# EAGLE design chargemaster (EAGLE 6.6.0)
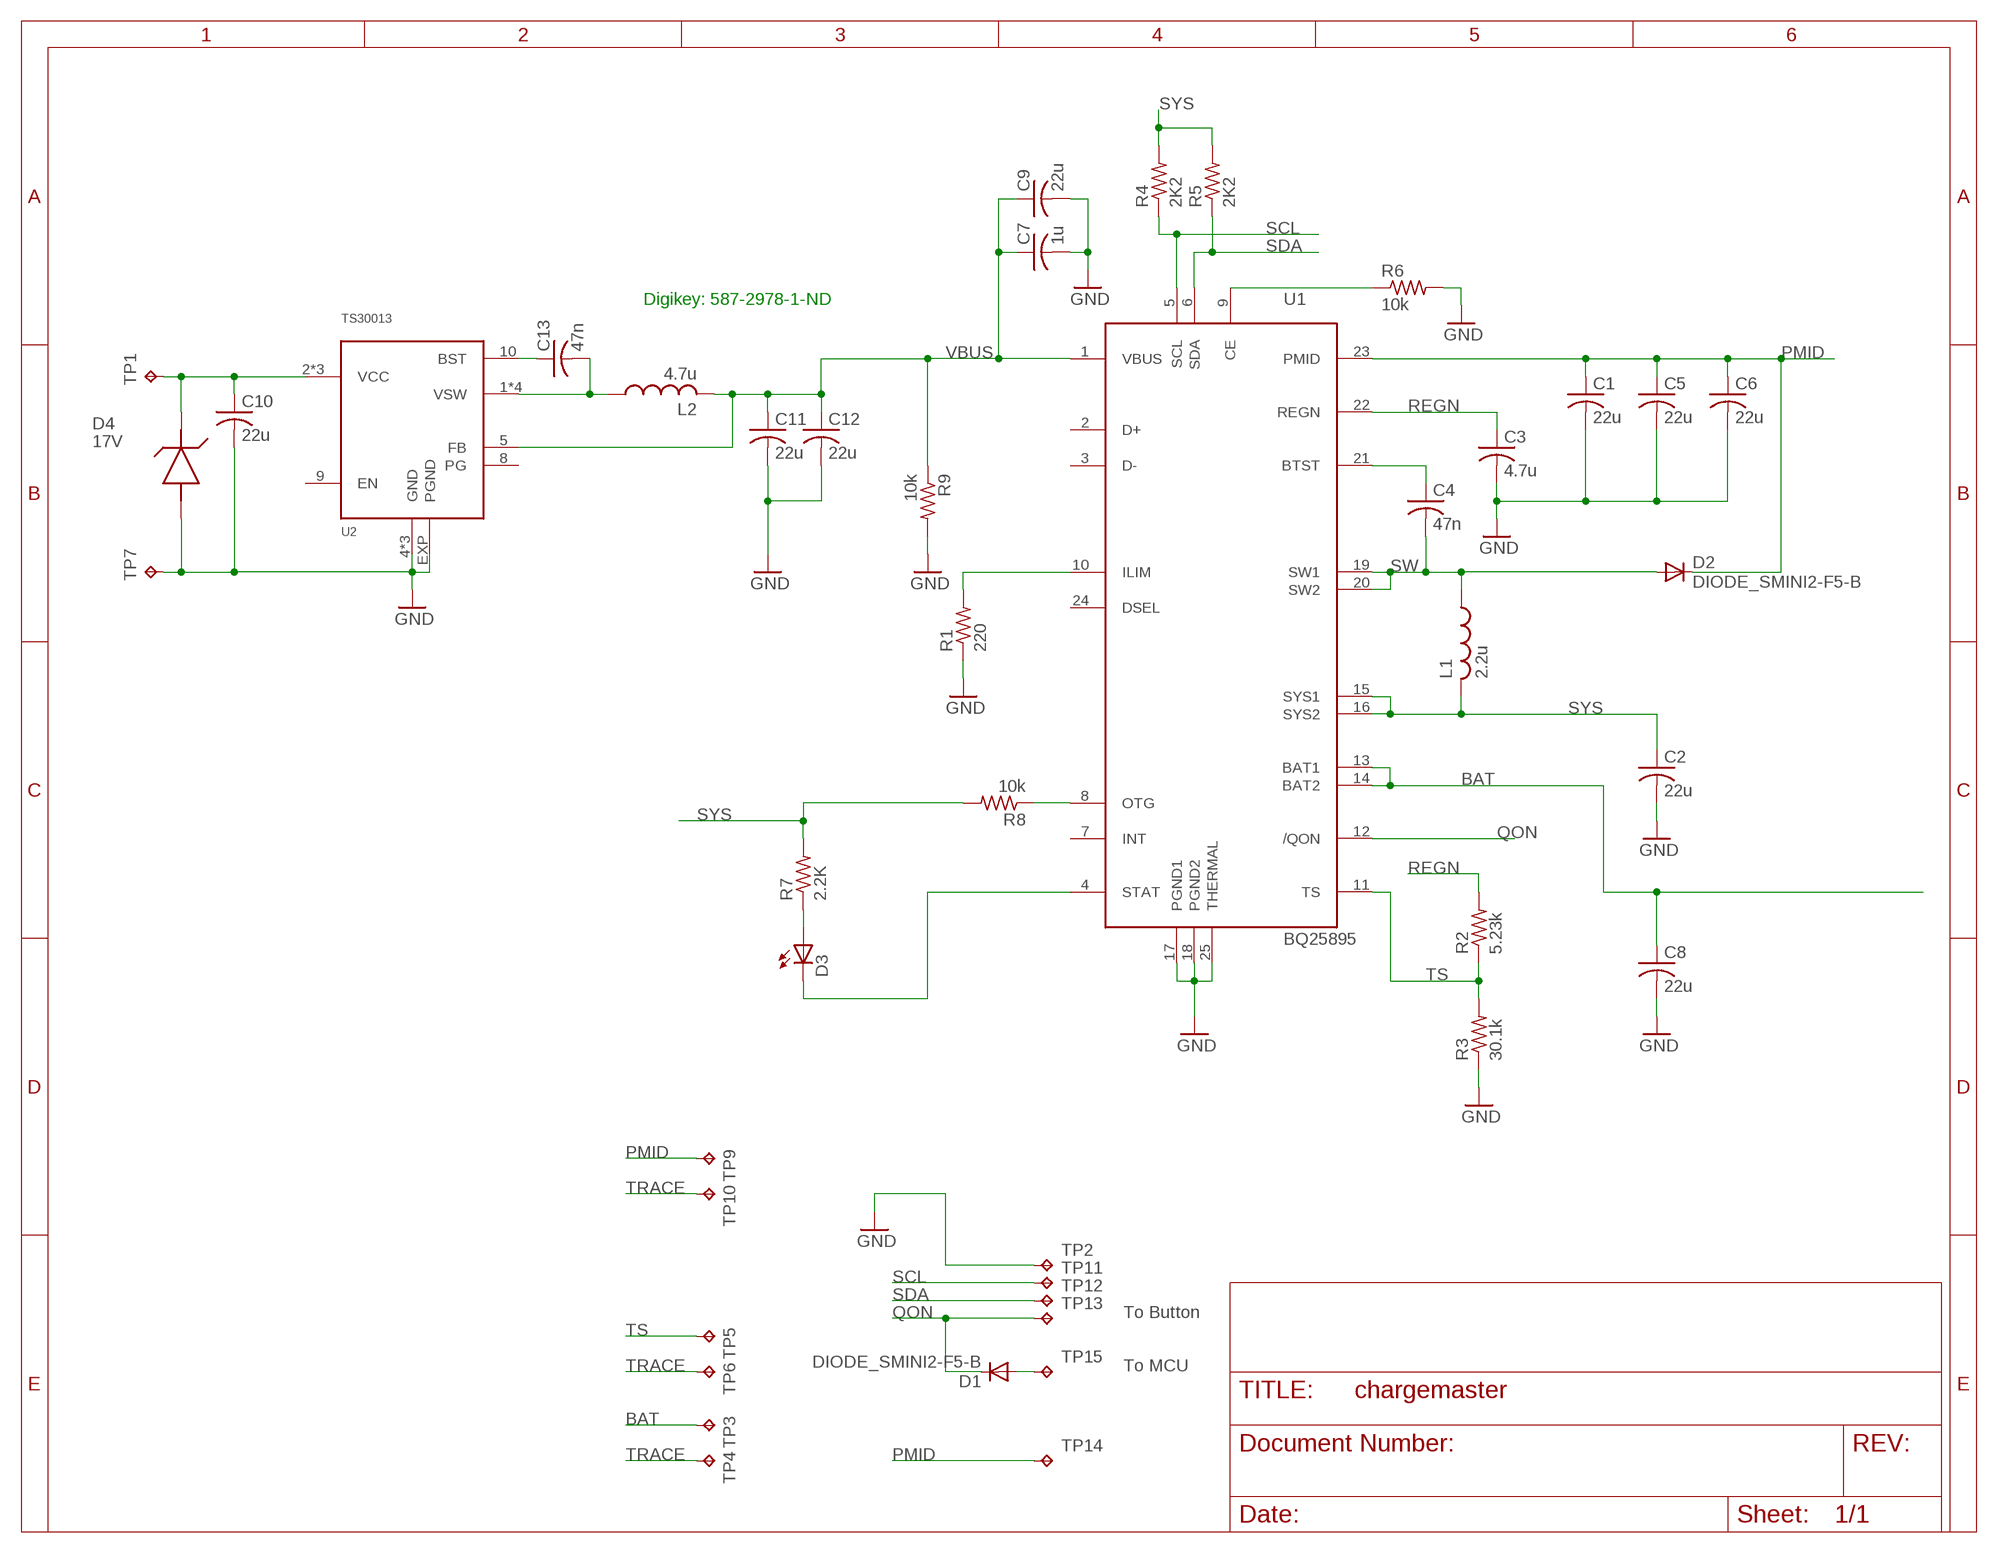
[diagram p0: schematic, sheet 1]

## Parts
C1  22u  C-USC1206  [C1206]
C2  22u  C-USC1206  [C1206]
C3  4.7u  C-USC0805  [C0805]
C4  47n  C-USC0402  [C0402]
C5  22u  C-USC1206  [C1206]
C6  22u  C-USC1206  [C1206]
C7  1u  C-USC0603  [C0603]
C8  22u  C-USC1206  [C1206]
C9  22u  C-USC1206  [C1206]
C10  22u  C-USC1206  [C1206]
C11  22u  C-USC1206  [C1206]
C12  22u  C-USC1206  [C1206]
C13  47n  C-USC0402  [C0402]
D1  DIODE_SMINI2-F5-B  [SMINI2-F5-B]
D2  DIODE_SMINI2-F5-B  [SMINI2-F5-B]
D3  LEDCHIP-LED0805  [CHIP-LED0805]
D4  17V  SMA_TVS  [SMA]
L1  2.2u  SRN8040TA  [SRN8040TA]
L2  4.7u  SRN8040TA  [SRN8040TA]
R1  220  R-US_R0603  [R0603]
R2  5.23k  R-US_R0603  [R0603]
R3  30.1k  R-US_R0603  [R0603]
R4  2K2  R-US_R0603  [R0603]
R5  2K2  R-US_R0603  [R0603]
R6  10k  R-US_R0603  [R0603]
R7  2.2K  R-US_R0603  [R0603]
R8  10k  R-US_R0603  [R0603]
R9  10k  R-US_R0603  [R0603]
TP1  TPPAD1-13Y  [P1-13Y]
TP2  TPPAD1-13Y  [P1-13Y]
TP3  TPPAD1-13Y  [P1-13Y]
TP4  TPPAD1-13Y  [P1-13Y]
TP5  TPPAD1-13Y  [P1-13Y]
TP6  TPPAD1-13Y  [P1-13Y]
TP7  TPPAD1-13Y  [P1-13Y]
TP9  TPPAD1-13Y  [P1-13Y]
TP10  TPPAD1-13Y  [P1-13Y]
TP11  TPPAD1-13Y  [P1-13Y]
TP12  TPPAD1-13Y  [P1-13Y]
TP13  TPPAD1-13Y  [P1-13Y]
TP14  TPPAD1-13Y  [P1-13Y]
TP15  TPPAD1-13Y  [P1-13Y]
U1  BQ25895  [QFN24_4X4]
U2  TS30013  [QFN16_3X3]

## Nets
BAT: C8.1 TP3.TP U1.13(BAT1) U1.14(BAT2)
BST: C13.1 U2.10(BST)
BTST: C4.1 U1.21(BTST)
N$1: D3.A R7.1
N$2: D3.C U1.4(STAT)
N$3: R1.2 U1.10(ILIM)
N$4: D1.P$1(A) TP15.TP
N$6: R6.1 U1.9(CE)
N$9: R8.1 U1.8(OTG)
PMID: C1.1 C5.1 C6.1 D2.P$2(C) TP9.TP TP14.TP U1.23(PMID)
QON: D1.P$2(C) TP13.TP U1.12(/QON)
REGN: C3.1 R2.2 U1.22(REGN)
SCL: R4.1 TP11.TP U1.5(SCL)
SDA: R5.1 TP12.TP U1.6(SDA)
SW: C4.2 D2.P$1(A) L1.P$1 U1.19(SW1) U1.20(SW2)
SYS: C2.1 L1.P$2 R4.2 R5.2 R7.2 R8.2 U1.15(SYS1) U1.16(SYS2)
TRACE: C1.2 C2.2 C3.2 C5.2 C6.2 C7.2 C8.2 C9.2 C10.2 C11.2 C12.2 D4.P$2(GND) R1.1 R3.1 R6.2 R9.2 TP2.TP TP4.TP TP6.TP TP7.TP TP10.TP U1.17(PGND1) U1.18(PGND2) U1.25(THERMAL) U2.4(GND) U2.14(GND) U2.15(GND) U2.EXP(PGND) ; supply symbol labelled GND
TS: R2.1 R3.2 TP5.TP U1.11(TS)
VBUS: C7.1 C9.1 C11.1 C12.1 L2.P$2 R9.1 U1.1(VBUS) U2.5(FB)
VIN: C10.1 D4.P$1(LINE) TP1.TP U2.2(VCC) U2.3(VCC) U2.11(VCC)
VSW: C13.2 L2.P$1 U2.1(VSW) U2.12(VSW) U2.13(VSW) U2.16(VSW)
Unconnected: U1.2(D+) U1.3(D-) U1.7(INT) U1.24(DSEL) U2.8(PG) U2.9(EN)

## Notes on the sheet
- Digikey: 587-2978-1-ND
- To Button
- To MCU

## Library data of the parts
C1-C13 = rcl:C-US: CAPACITOR, American symbol
D1 D2 = sapphire:DIODE_SMINI2-F5-B
D3 = adafruit:LED: LED OSRAM: - CHIPLED LG R971, LG N971, LY N971, LG Q971, LY Q971, LO R971, LY R971 LH N974, LH R974 LS Q976, LO Q976, LY Q976 LO Q996 - Hyper CHIPLED LW Q18S LB Q993, LB Q99A, LB R99A - SideLED LS A670, LO A670, LY A670, LG A670, LP A670 LB A673, LV A673, LT A673, LW A673 LH A674 LY A675 LS A676, LA A676, LO A676, LY A676, LW A676 LS A679, LY A679, LG A679 - Hyper Micro SIDELED® LS Y876, LA Y876, LO Y876, LY Y876 LT Y87S - SmartLED LW L88C, LW L88S LB L89C, LB L89S, LG L890 LS L89K, LO L89K, LY L89K LS L896, LA L896, LO L896, LY L896 - TOPLED LS T670, LO T670, LY T670, LG T670, LP T670 LSG T670, LSP T670, LSY T670, LOP T670, LYG T670 LG T671, LOG T671, LSG T671 LB T673, LV T673, LT T673, LW T673 LH T674 LS T676, LA T676, LO T676, LY T676, LB T676, LH T676, LSB T676, LW T676 LB T67C, LV T67C, LT T67C, LS T67K, LO T67K, LY T67K, LW E67C LS E67B, LA E67B, LO E67B, LY E67B, LB E67C, LV E67C, LT E67C LW T67C LS T679, LY T679, LG T679 LS T770, LO T770, LY T770, LG T770, LP T770 LB T773, LV T773, LT T773, LW T773 LH T774 LS E675, LA E675, LY E675, LS T675 LS T776, LA T776, LO T776, LY T776, LB T776 LHGB T686 LT T68C, LB T68C - Hyper Mini TOPLED® LB M676 - Mini TOPLED Santana® LG M470 LS M47K, LO M47K, LY M47K Source: http://www.osram.convergy.de/
D4 = sapphire:SMA_TVS
L1 L2 = sapphire:SRN8040TA
R1-R9 = rcl:R-US_: RESISTOR, American symbol
TP1-TP7 TP9-TP15 = testpad:TP: Test pad
U1 = sapphire:BQ25895
U2 = sapphire:TS30013

## Board
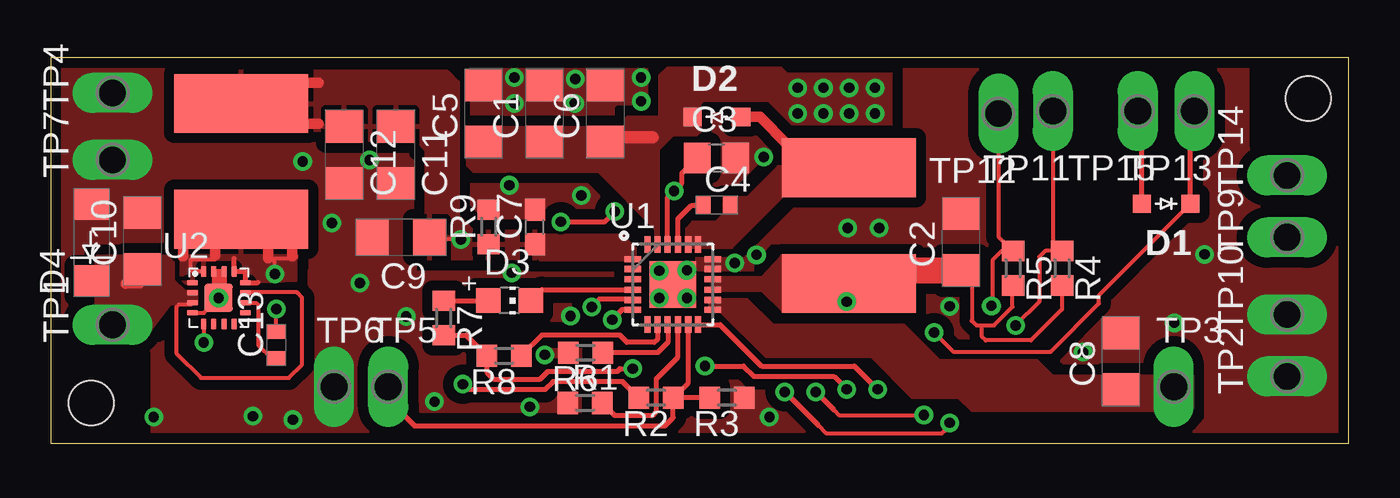
[diagram p1: board, top side]
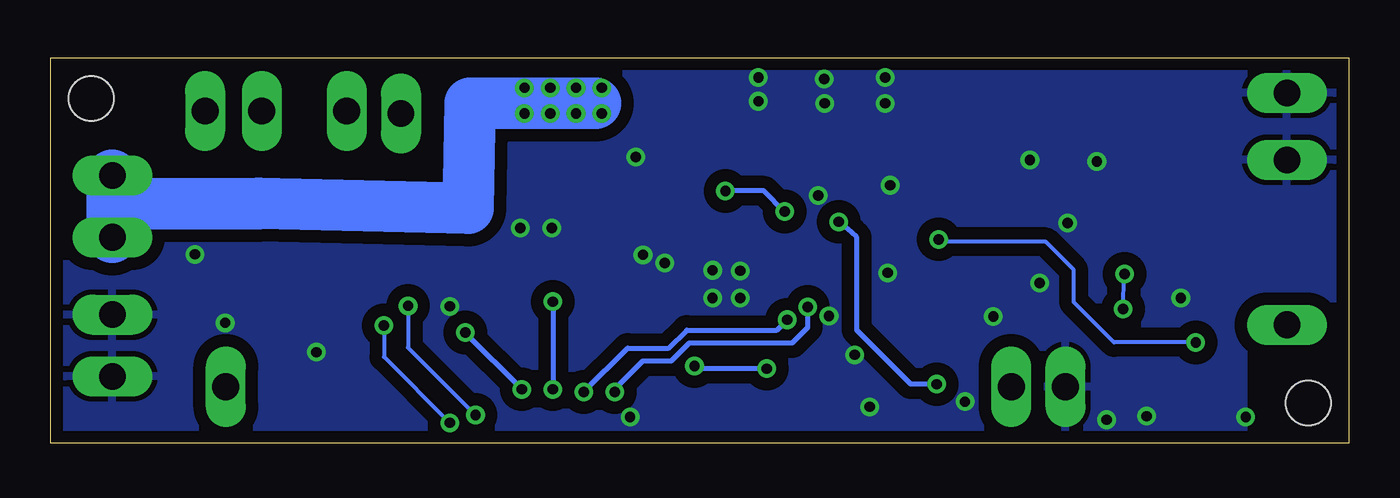
[diagram p2: board, bottom side, seen from below]

Size 64 x 19 mm. Coordinates in mm from the lower left corner, seen from the top.
Outline: 0,0 64,0 64,19 0,19 0,0
Copper layers (1*16): Top 0.035mm / dielectric 1.5mm / Bottom 0.035mm
Design rules "default *": minimum track width 6mil, minimum drill 20mil, track to track 6mil, track to pad 6mil, pad to pad 6mil, via to via 6mil, smd to smd 6mil, copper to edge 15mil, drill to drill 6mil, minimum pad ring 10mil, minimum via ring 8mil, stop-mask expansion 4mil, vias tented up to drill 0mil, thermal gap 10mil
Holes 2.2 mm at 2,2 62,17
tKeepout: area -0.1,0 to 0.4,19.1; area 0,-0.1 to 64,0.4; area 63.6,0 to 64.1,19.1; area -0.1,18.6 to 64,19.1
tRestrict: area 59.6,14.7 to 63.6,18.7; area 0.4,0.4 to 4.4,4.4
bRestrict: area 59.6,14.7 to 63.6,18.7; area 0.4,0.4 to 4.4,4.4

### Footprints (pad centres in the part's own frame; a part is rotated, then mirrored left to right if it is on the bottom)
C1206 = smd 1.6 x 1.8: 1 -1.4,0; 2 1.4,0
C0805 = smd 1.3 x 1.5: 1 -0.95,0; 2 0.95,0
C0402 = smd 0.7 x 0.9: 1 -0.65,0; 2 0.65,0
C0603 = smd 1.1 x 1: 1 -0.85,0; 2 0.85,0
SMINI2-F5-B = smd 0.9 x 0.9: P$1 0,1.2; P$2 0,-1.2
CHIP-LED0805 = smd 1.2 x 1.2: A 0,-1.05; C 0,1.05
SMA = smd 1.524 x 1.676: P$1 -1.829,-0.051; P$2 1.93,-0.051
SRN8040TA = smd 6.6 x 2.9: P$1 3.3,1.4; P$2 3.3,7.1
R0603 = smd 1 x 1.1: 1 -0.85,0; 2 0.85,0
P1-13Y = drill 1.321 pad 1.905 long: TP 0,0
QFN24_4X4 = smd 0.813 x 0.305: 1 -1.98,1.245; 2 -1.98,0.762; 3 -1.98,0.254; 4 -1.98,-0.254; 5 -1.98,-0.762; 6 -1.98,-1.245; 13 1.98,-1.245; 14 1.98,-0.762; 15 1.98,-0.254; 16 1.98,0.254; 17 1.98,0.762; 18 1.98,1.245 | smd 0.305 x 0.813: 7 -1.245,-1.98; 8 -0.762,-1.98; 9 -0.254,-1.98; 10 0.254,-1.98; 11 0.762,-1.98; 12 1.245,-1.98; 19 1.245,1.98; 20 0.762,1.98; 21 0.254,1.98; 22 -0.254,1.98; 23 -0.762,1.98; 24 -1.245,1.98 | smd 2.286 x 2.286: 25 0,0
QFN16_3X3 = smd 0.559 x 0.279: 1 -1.387,0.818; 2 -1.387,0.318; 3 -1.387,-0.182; 4 -1.387,-0.682; 9 1.212,-0.682; 10 1.212,-0.182; 11 1.212,0.318; 12 1.212,0.818 | smd 0.279 x 0.559: 5 -0.838,-1.232; 6 -0.338,-1.232; 7 0.163,-1.232; 8 0.662,-1.232; 13 0.662,1.367; 14 0.163,1.367; 15 -0.338,1.367; 16 -0.838,1.367 | smd 1.4 x 1.4: EXP -0.107,0.068

### Placement (x,y rotation side)
C1  24.34,16.25 90 top
C2  44.87,9.93 90 top
C3  32.83,14.07 0 top
C4  32.84,11.75 0 top
C5  21.34,16.25 90 top
C6  27.34,16.25 90 top
C7  23.88,10.67 90 top
C8  52.77,4.05 90 top
C9  17.27,10.16 180 top
C10  4.52,9.98 90 top
C11  17.02,14.22 270 top
C12  14.48,14.22 270 top
C13  11.13,4.85 90 top
D1  54.99,11.81 90 top
D2  32.84,16.09 270 top
D3  22.63,7.04 270 top
D4  1.98,9.86 90 top
L1  42.66,14.98 180 top
L2  6.1,9.65 0 top
R1  26.34,2 0 top
R2  29.84,2.25 180 top
R3  33.34,2.25 180 top
R4  49.86,8.64 270 top
R5  47.45,8.64 270 top
R6  26.37,4.47 180 top
R7  19.38,6.18 270 top
R8  22.35,4.32 180 top
R9  21.59,10.67 90 top
TP1  3.05,5.84 90 top
TP2  60.96,3.3 90 top
TP3  55.37,2.79 0 top
TP4  3.05,17.27 90 top
TP5  16.64,2.79 0 top
TP6  13.97,2.79 0 top
TP7  3.05,13.97 90 top
TP9  60.96,10.16 90 top
TP10  60.96,6.35 90 top
TP11  49.4,16.38 180 top
TP12  46.74,16.26 180 top
TP13  56.39,16.38 180 top
TP14  60.96,13.21 90 top
TP15  53.59,16.38 180 top
U1  30.67,7.83 0 top
U2  8.38,7.11 0 top

### Tracks (layer width: path | path; a pad name or v marks a point on that pad's centre or on a via)
ATS
  Top 0.203: 8.18,8.31 8.38,8.31 | 8.2,7.87 8.2,8.28 8.18,8.31 | 8.38,8.31 8.38,7.9 | 8.59,7.87 8.59,8.28 8.56,8.31 8.38,8.31 | 8.1,8.31 8.18,8.31
BAT
  pour Top (no thermals): 32.46,7.16 34.34,7.16 35.61,5.89 41.86,5.89 40.44,4.22 35.26,4.22 33.02,6.45 32.56,6.45 32.46,6.55
  pour Top (no thermals): 56.13,1.52 56.11,1.55 48.69,1.55 45.42,1.55 44.75,2.21 42.47,2.21 40.44,4.24 40.44,4.52 41.81,5.89 42.06,5.89 43.81,4.14 48.62,4.14 49.38,3.38 56.31,3.38 56.34,3.35 56.34,1.73
BST
  Top 0.203: C13.1 10.89,4.2 10.26,4.83 10.26,6.81 10.16,6.91 9.62,6.91 U2.10
BTST
  Top 0.254: U1.21 30.93,11.06 31.6,11.73 32.17,11.73 C4.1
N$1
  Top 0.254: R7.1 D3.A
N$2
  Top 0.254: D3.C 24.22,7.58 U1.4
N$3
  Top 0.254: U1.10 30.93,4.26 29.84,3.17 29.84,1.55 29.67,1.37 27.82,1.37 R1.2
N$4
  Top 0.254: D1.P$1 53.79,16.06 TP15.TP
N$6
  Top 0.254: U1.9 30.43,4.98 29.92,4.47 R6.1
N$9
  Top 0.254: U1.8 29.91,5.12 29.77,4.98 28.4,4.98 28.4,5 28.07,5.33 24.22,5.33 R8.1
PMID  (via drill 0.51)
  Top 0.61: 29.67,15.09 27.64,15.09 27.33,14.78 27.43,14.78 27.48,14.83
  Bottom 0.254: 37.13,16.76 37.13,17.22 v36.83,17.53
  Bottom 2.54: TP9.TP 60.96,11.81 | 60.96,11.81 TP14.TP | 37.13,16.76 43.33,16.76 43.43,11.58 53.75,11.84 53.77,11.81 60.96,11.81
  other vias: 36.83,16.26 38.1,16.26 38.1,17.53 39.37,17.53 39.37,16.26 40.64,16.26 40.64,17.53
  pour Top (no thermals): 30.02,9.55 30.02,15.04 29.46,15.6 20.52,15.6 20.47,15.54 20.47,13.72 20.83,13.36 26.97,13.36 29.77,10.57 29.77,9.55
  pour Top (no thermals): 32.05,15.9 32.05,15.34 31.85,15.14 30.68,15.14 29.97,14.43 28.6,14.43 28.35,14.68 28.35,16.05 28.45,16.15 30.63,16.15 30.99,16.51 31.95,16.51 32,16.46 32,15.95
  pour Top (no thermals): 32.05,15.44 32.05,16.71 32.21,16.87 35.36,16.87 36.53,15.7 41.5,15.7 41.5,18.24 36.32,18.24 36.02,18.54 30.38,18.54 29.97,18.14 29.97,15.49 29.92,15.44
QON  (via drill 0.51)
  Top 0.203: v43.56,5.46 44.5,4.52 49.3,4.52 51.69,6.91 51.69,7.31 D1.P$2
  Top 0.254: U1.12 33.01,5.85 35.05,3.81 39.62,3.81 v40.77,2.67 | D1.P$2 56.19,16.06 TP13.TP
  Bottom 0.254: v40.77,2.67 v43.56,5.46
REGN  (via drill 0.51)
  Top 0.254: R2.2 28.32,2.92 28.19,3.05 24.77,3.05 24.38,2.67 20.57,2.67 v20.32,2.92 | U1.22 30.42,12.13 v30.73,12.45 31.11,12.83 31.11,13.31 C3.1 | v25.15,10.92 27.3,10.92 v27.81,11.43
  Bottom 0.254: v25.15,10.92 24.51,10.41 24.26,10.16 24.26,5.59 21.59,2.92 v20.32,2.92 | v27.81,11.43 28.83,12.45 v30.73,12.45
SCL  (via drill 0.51)
  Top 0.203: 49.53,16.26 TP11.TP 49.4,9.94 R4.1 49.03,9.49 48.74,9.2 48.74,6.99 v47.57,5.82 | 44.07,0.64 43.92,0.48 38.25,0.48 37.85,0.89
  Top 0.254: U1.5 28.65,7.11 27.05,7.11 v26.67,6.73 | v44.32,1.02 44.32,0.89 44.07,0.64 | 37.85,0.89 v36.2,2.54
  Bottom 0.203: v47.57,5.82 47.57,4.27 v44.32,1.02
  Bottom 0.254: v36.2,2.54 36.2,2.67 34.8,4.06 33.4,4.06 32.51,4.95 27.43,4.95 26.67,5.71 v26.67,6.73
SDA  (via drill 0.51)
  Top 0.203: TP12.TP 46.74,10.2 R5.1 46.9,9.49 46.43,9.02 46.43,6.83 v46.38,6.78 | 38.61,1.65 38.86,1.4 v43.05,1.4
  Top 0.254: U1.6 28.18,6.59 v27.69,6.1 | 38.61,1.65 v37.72,2.54
  Bottom 0.203: v46.38,6.78 46.38,4.72 v43.05,1.4
  Bottom 0.254: v37.72,2.54 35.56,4.7 33.53,4.7 32.64,5.59 28.19,5.59 v27.69,6.1
SW
  Top 0.508: D2.P$1 34.96,16.09 36.32,14.73 38.21,14.73 L1.P$1
  pour Top (no thermals): 31.34,9.65 31.34,10.62 31.65,10.92 32.77,10.92 33.17,11.33 33.17,11.79 33.53,12.14 34.34,12.14 35.86,13.67 40.03,13.67 40.34,13.36 40.34,12.19 36.12,12.19 33.58,9.65
SYS  (via drill 0.51)
  Top 0.203: C2.1 45.09,8.53 45.67,7.95 45.49,7.95 45.41,7.87 45.41,6.04 45.64,5.82 45.92,5.82 | 45.92,5.82 46.51,5.82 47.42,6.73 47.42,7.76 R5.2 | R4.2 49.86,6.6 48.34,5.08 46.1,5.08 45.92,5.26 45.92,5.82
  Top 0.254: R7.2 20.49,5.33 R8.2 21.5,3.52 21.84,3.17 24.13,3.17 24.51,3.56 27.94,3.56 28.07,3.68 v28.7,3.68 | v32.26,3.81 34.16,3.81 34.67,3.3 38.61,3.3 v39.24,2.67
  Top 1.27: C2.1 44.85,8.51 40.51,8.51 39.89,7.88 L1.P$2
  Bottom 0.254: v39.24,6.99 v39.24,2.67 | v28.7,3.68 32.13,3.68 v32.26,3.81
  pour Top (no thermals): 32.61,8.18 32.61,7.52 35.05,7.52 36.07,6.5 41.3,6.5 41.3,9.25 36.02,9.25 35.05,8.18
TRACE  (via drill 0.51)
  Top 0.203: U2.4 7.55,6.43 v8.28,7.16 | U2.EXP 8.04,7.41 U2.15 U2.14
  other vias: 22.86,18.03 22.86,16.76 29.11,18.03 29.11,16.87 35.15,14.12 30,8.51 31.37,8.53 31.37,7.16 30,7.16 33.73,8.89 34.8,9.3 25.63,6.27 25.86,17.96 44.32,6.76 50.9,4.5 25.83,16.76 35.43,1.3 23.62,1.8 18.92,2.06 17.53,6.25 9.96,1.34 5.08,1.3 11.94,1.17 15.24,7.9 22.73,8.41 56.9,9.32 55.4,5.94 26.16,12.22 22.61,12.73 24.36,4.37 13.87,10.87 12.42,13.89 15.72,13.97 40.84,10.62 39.29,10.62
  pour Bottom (isolate 0.61): -0.48,19.96 64.43,19.45 64.94,-0.9 -0.48,-0.4
  pour Top (isolate 0.508, rank 5, no thermals): -1.4,20.32 65.28,20.32 65.28,-1.65 -1.4,-1.65
  pour Top (no thermals): 34.67,9.14 31.8,9.14 31.8,8.51 34.67,8.51
TS
  Top 0.254: R3.2 R2.1 | R2.1 31.43,3 U1.11 | TP5.TP 16.64,2.16 17.93,0.86 30.28,0.86 30.68,1.27 R2.1
VBUS  (via drill 0.51)
  Top 0.203: U2.5 v7.54,4.98 | v20.22,10.06 18.77,10.06 C9.1
  Top 0.508: 12.45,17.78 13.21,17.78 | 12.45,15.75 13.21,15.75
  Bottom 0.203: v7.54,4.98 11.58,4.98 13.56,6.96 13.56,8.56 14.94,9.93 20.09,9.93 v20.22,10.06
  pour Top (no thermals): 28.83,9.02 24.13,9.02 23.88,9.27 23.88,10.29 28.19,10.29 28.83,9.65
  pour Top: 6.35,15.49 13.21,15.49 13.72,14.99 18.03,14.99 18.54,14.48 18.54,9.14 24.38,9.14 24.38,10.41 21.08,10.41 20.83,10.41 20.07,11.18 20.07,17.78 19.56,18.29 6.35,18.29
VIN
  Top 0.203: U2.3 6.92,6.86 6.33,6.86 6.22,6.76 6.22,4.42 7.42,3.23 11.73,3.23 12.39,3.89 12.39,7.19 12.14,7.44 9.61,7.44 U2.11
  Top 0.508: 3.71,7.87 3.73,7.9 4.39,7.9 | 4.5,9.02 4.45,9.07 3.81,9.07
  pour Top (no thermals): 7.21,6.86 7.21,7.52 6.63,7.52 6.07,8.08 6.07,8.94 5.77,9.25 2.29,9.25 2.21,9.17 2.21,7.85 2.18,5.54 4.9,5.56 5.92,6.88 5.94,6.86
VSW  (via drill 0.51)
  Top 0.203: 10.72,9.12 11.07,9.12 | 11.07,9.12 11.89,9.12 11.89,9.2 11.86,9.2 | U2.16 7.01,8.48 7.01,8.53 6.91,8.53 6.91,9.07 8.1,9.07 8.1,9.27 | C13.2 v11.12,6.63 | v11.05,8.36 11.05,9.09 11.07,9.12
  Top 0.254: 9.7,7.92 10.21,7.92 | 9.6,7.92 9.6,8.46 9.07,8.46 U2.13 9.04,9.12
  Top 0.508: 6.5,9.22 6.53,9.22 6.53,9.8 | 8.1,9.27 8.1,9.83 | 10.72,9.12 10.72,9.86 | 11.94,9.22 11.91,9.22 11.91,9.93
  Bottom 0.203: v11.12,6.63 11.1,8.31 v11.05,8.36
  pour Top: 9.6,7.9 9.6,8.43 8.99,8.43 8.99,9.17 12.09,9.17 12.09,8.03 11,7.98 10.34,7.95 10.21,7.9
  pour Top: 7.09,7.92 6.71,7.92 6.48,8.15 6.48,9.12 7.54,9.12 7.54,8.38 7.11,8.38 7.11,7.9
  pour Top: 6.43,9.12 12.09,9.12 12.09,10.62 6.63,10.62 6.4,10.62 6.4,9.12

### Text on the board
Silk: GND | SCL | BTN | SDA | 5V | to MCU | VIN | TS- | TS+ | GND | BAT+